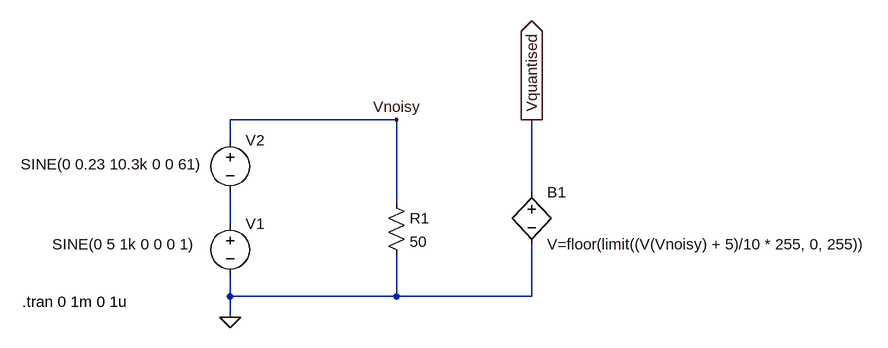
[diagram p0: schematic VoltageSourceWithNoise.asc]
VoltageSourceWithNoise.asc, the LTspice schematic file:
Version 4
SHEET 1 1108 680
WIRE 288 0 32 0
WIRE 32 32 32 0
WIRE 496 112 496 0
WIRE 288 128 288 0
WIRE 32 160 32 112
WIRE 32 272 32 240
WIRE 288 272 288 208
WIRE 288 272 32 272
WIRE 496 272 496 192
WIRE 496 272 288 272
WIRE 32 304 32 272
FLAG 32 304 0
FLAG 288 0 Vnoisy
FLAG 496 0 Vquantised
IOPIN 496 0 Out
SYMBOL voltage 32 144 R0
WINDOW 3 -274 48 Left 2
WINDOW 123 0 0 Left 0
WINDOW 39 0 0 Left 0
SYMATTR Value SINE(0 5 1k 0 0 0 1)
SYMATTR InstName V1
SYMBOL voltage 32 16 R0
WINDOW 3 -322 53 Left 2
WINDOW 123 0 0 Left 0
WINDOW 39 0 0 Left 0
SYMATTR Value SINE(0 0.23 10.3k 0 0 61)
SYMATTR InstName V2
SYMBOL res 272 112 R0
SYMATTR InstName R1
SYMATTR Value 50
SYMBOL bv 496 96 R0
SYMATTR InstName B1
SYMATTR Value V=floor(limit((V(Vnoisy) + 5)/10 * 255, 0, 255))
TEXT -288 280 Left 2 !.tran 0 1m 0 1u

The netlist it stands for:
* VoltageSourceWithNoise.asc
V1 N001 0 SINE(0 5 1k 0 0 0 1)
V2 Vnoisy N001 SINE(0 0.23 10.3k 0 0 61)
R1 Vnoisy 0 50
B1 Vquantised 0 V=floor(limit((V(Vnoisy) + 5)/10 * 255, 0, 255))
.tran 0 1m 0 1u
.backanno
.end

* Results of the author's LTspice run, read from the files saved beside the schematic
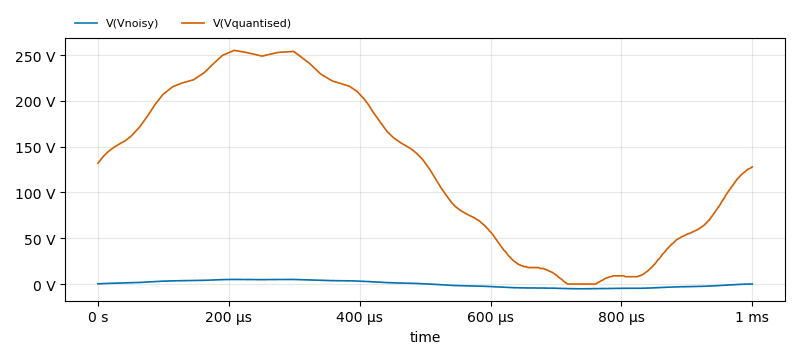
[diagram p1: Transient Analysis of VoltageSourceWithNoise.asc, plotted from the saved traces]
* Transient Analysis, 1 run:
*   V(Vnoisy): min -5.209 V, max 5.038 V, average 5.44 mV, rms 3.536 V, last 43.89 mV
*   V(Vquantised): min 0 V, max 255.2 V, average 127.3 V, rms 155.9 V, last 128 V